# EasyEDA schematic DFPLAYER.json
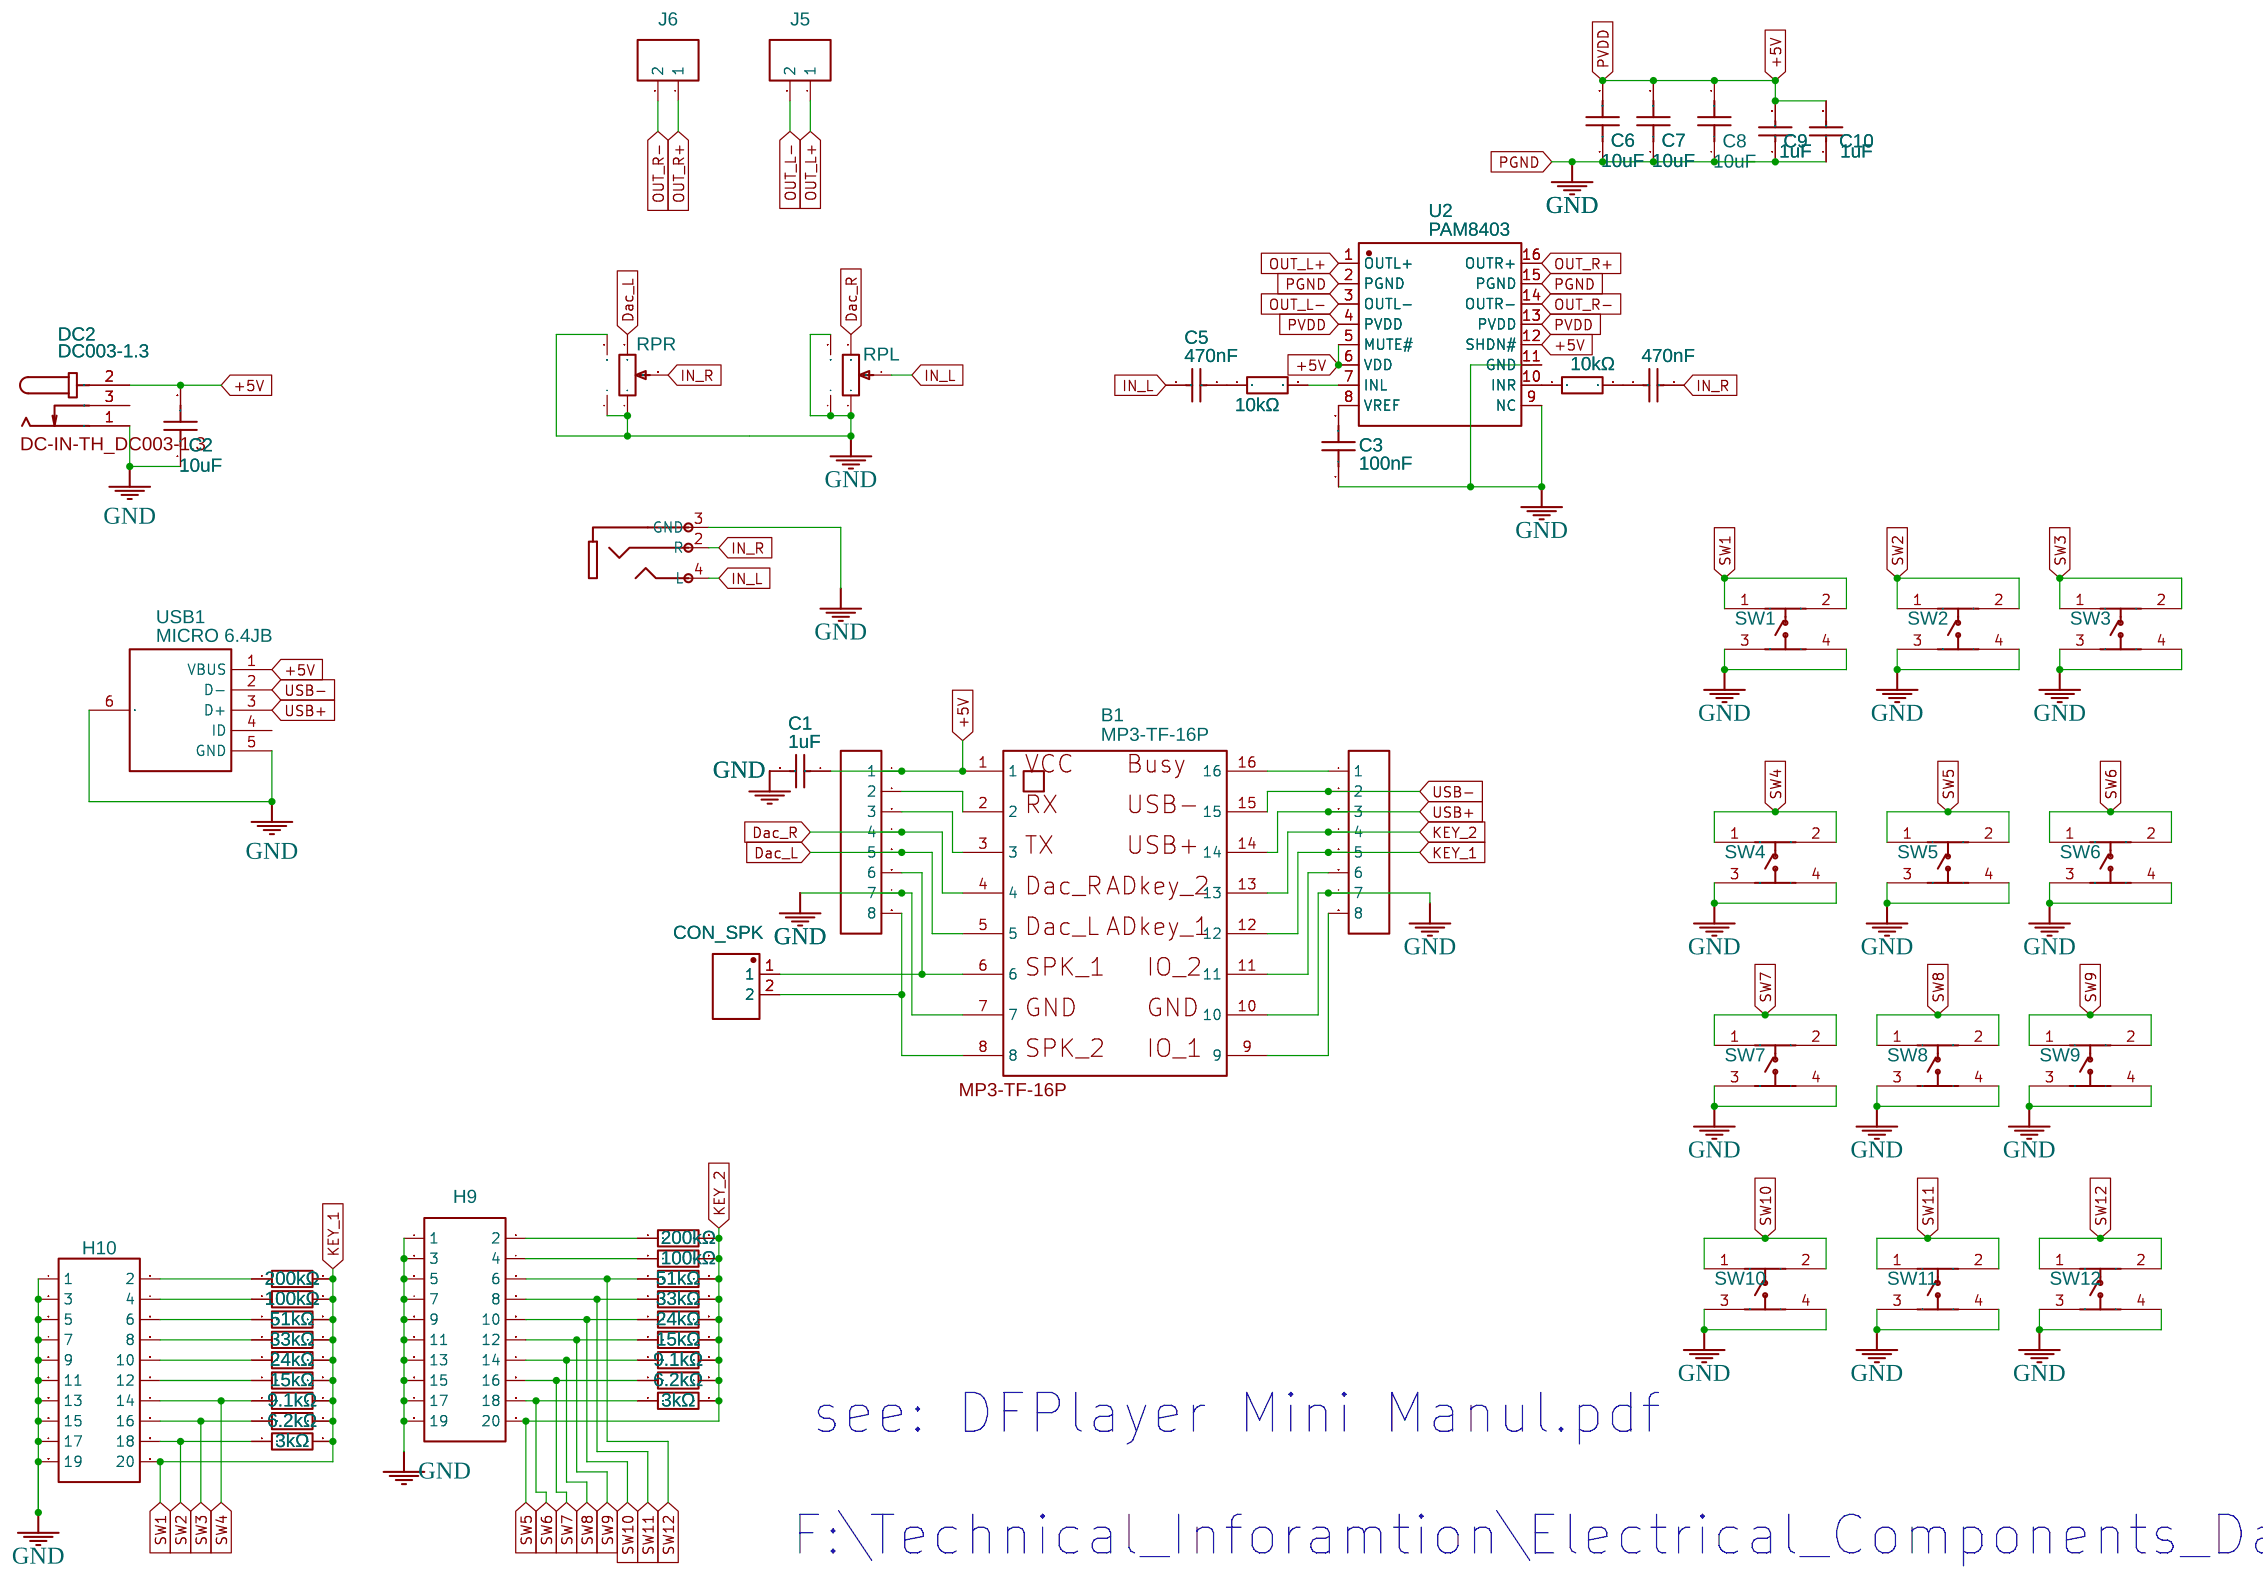
[diagram p0: schematic sheet]

## Parts
B1  MP3-TF-16P  [MP3-TF-16P]
C1  1uF  [C0603]
C2  10uF  [C0603]
C3  100nF  [C0603]
C4  470nF  [C0603]
C5  470nF  [C0603]
C6  10uF  [C0603]
C7  10uF  [C0603]
C8  10uF  [C0603]
C9  1uF  [C0603]
C10  1uF  [C0603]
CON_SPK  640456-2  [CONN-TH_KF2510-2A]
DC2  DC003-1.3  [DC-IN-TH_DC003-1.3]
H9  HDR-F-2.54_2x10  [HDR-F-2.54_2X10]
H10  HDR-F-2.54_2x10  [HDR-F-2.54_2X10]
J1  HDR-M-2.54_1x8  [HDR-M-2.54_1X8]
J2  HDR-M-2.54_1x8  [HDR-M-2.54_1X8]
J3  Black headphone jack  [AUDIO-TH_PJ-3200]
J5  HDR-M-2.54_1x2  [HDR-M-2.54_1X2]
J6  HDR-M-2.54_1x2  [HDR-M-2.54_1X2]
R2  3kΩ  [R0603]
R3  6.2kΩ  [R0603]
R4  9.1kΩ  [R0603]
R5  15kΩ  [R0603]
R6  24kΩ  [R0603]
R7  33kΩ  [R0603]
R8  51kΩ  [R0603]
R9  100kΩ  [R0603]
R10  200kΩ  [R0603]
R11  10kΩ  [R0603]
R12  3kΩ  [R0603]
R13  6.2kΩ  [R0603]
R14  9.1kΩ  [R0603]
R15  15kΩ  [R0603]
R16  24kΩ  [R0603]
R17  33kΩ  [R0603]
R18  51kΩ  [R0603]
R19  100kΩ  [R0603]
R20  200kΩ  [R0603]
R21  10kΩ  [R0603]
RPL  长柄旋转电位器  [RES-ADJ-TH_RV09]
RPR  长柄旋转电位器  [RES-ADJ-TH_RV09]
SW1  6.0*6.0*6.0  [SW-SMD_4P-L6.0-W6.0-P4.50-LS8.6]
SW2  6.0*6.0*6.0  [SW-SMD_4P-L6.0-W6.0-P4.50-LS8.6]
SW3  6.0*6.0*6.0  [SW-SMD_4P-L6.0-W6.0-P4.50-LS8.6]
SW4  6.0*6.0*6.0  [SW-SMD_4P-L6.0-W6.0-P4.50-LS8.6]
SW5  6.0*6.0*6.0  [SW-SMD_4P-L6.0-W6.0-P4.50-LS8.6]
SW6  6.0*6.0*6.0  [SW-SMD_4P-L6.0-W6.0-P4.50-LS8.6]
SW7  6.0*6.0*6.0  [SW-SMD_4P-L6.0-W6.0-P4.50-LS8.6]
SW8  6.0*6.0*6.0  [SW-SMD_4P-L6.0-W6.0-P4.50-LS8.6]
SW9  6.0*6.0*6.0  [SW-SMD_4P-L6.0-W6.0-P4.50-LS8.6]
SW10  6.0*6.0*6.0  [SW-SMD_4P-L6.0-W6.0-P4.50-LS8.6]
SW11  6.0*6.0*6.0  [SW-SMD_4P-L6.0-W6.0-P4.50-LS8.6]
SW12  6.0*6.0*6.0  [SW-SMD_4P-L6.0-W6.0-P4.50-LS8.6]
U2  PAM8403  [SOP-16_L10.0-W3.9-P1.27-LS6.0-BL]
USB1  MICRO 6.4JB  [MICRO-USB-SMD_C2681558]

## Library data of the parts
B1 = MP3-TF-16P: Contributor: exco; sourceId: QaGYSM3lD; Package Display: Yes
C1 C9 C10 = CL10A105KB8NNNC: Supplier: LCSC; Manufacturer: SAMSUNG(三星); Supplier Part: C15849; JLCPCB Part Class: Basic Part; Package Display: No
C2 C6-C8 = CL10A106MA8NRNC: Supplier: LCSC; Manufacturer: SAMSUNG(三星); Supplier Part: C96446; JLCPCB Part Class: Basic Part; Package Display: No
C3 = CC0603KRX7R9BB104: Supplier: LCSC; Manufacturer: YAGEO(国巨); Supplier Part: C14663; JLCPCB Part Class: Basic Part; Package Display: No
C4 C5 = CL10B474KA8NNNC: Supplier: LCSC; Manufacturer: SAMSUNG(三星); Supplier Part: C1623; JLCPCB Part Class: Basic Part; Package Display: No
CON_SPK = 640456-2: Supplier: LCSC; Manufacturer: TE Connectivity; Supplier Part: C86502; JLCPCB Part Class: Extended Part; Package Display: No
DC2 = DC003-1.3: Contributor: LCSC; Supplier: LCSC; Supplier Part: C668594; Manufacturer: SHOU HAN(首韩); JLCPCB Part Class: Extended Part; Package Display: Yes
H9 H10 = HDR-F-2.54_2x10: Supplier Part: C30867; Supplier: LCSC; Contributor: LCEDA_Lib; Package Display: No
J1 J2 = HDR-M-2.54_1x8: Supplier Part: C190820; Supplier: LCSC; Contributor: LCEDA_Lib; Package Display: No
J3 = Black headphone jack: Supplier: LCSC; Manufacturer: BOOMELE(博穆精密); Supplier Part: C18166; JLCPCB Part Class: Extended Part; Package Display: No
J5 J6 = HDR-M-2.54_1x2: Supplier Part: C124375; Supplier: LCSC; Contributor: LCEDA_Lib; Package Display: No
R2 R12 = 0603WAF3001T5E: Supplier: LCSC; Manufacturer: UNI-ROYAL(厚声); Supplier Part: C4211; JLCPCB Part Class: Basic Part; Package Display: No
R3 R13 = 0603WAF6201T5E: Supplier: LCSC; Manufacturer: UNI-ROYAL(厚声); Supplier Part: C4260; JLCPCB Part Class: Basic Part; Package Display: No
R4 R14 = 0603WAF9101T5E: Supplier: LCSC; Manufacturer: UNI-ROYAL(厚声); Supplier Part: C23260; Package Display: No
R5 R15 = 0603WAF1502T5E: Supplier: LCSC; Manufacturer: UNI-ROYAL(厚声); Supplier Part: C22809; JLCPCB Part Class: Basic Part; Package Display: No
R6 R16 = 0603WAF2402T5E: Supplier: LCSC; Manufacturer: UNI-ROYAL(厚声); Supplier Part: C23352; JLCPCB Part Class: Basic Part; Package Display: No
R7 R17 = 0603WAF3302T5E: Supplier: LCSC; Manufacturer: UNI-ROYAL(厚声); Supplier Part: C4216; JLCPCB Part Class: Basic Part; Package Display: No
R8 R18 = 0603WAF5102T5E: Supplier: LCSC; Manufacturer: UNI-ROYAL(厚声); Supplier Part: C23196; JLCPCB Part Class: Basic Part; Package Display: No
R9 R19 = 0603WAF1003T5E: Supplier: LCSC; Manufacturer: UNI-ROYAL(厚声); Supplier Part: C25803; JLCPCB Part Class: Basic Part; Package Display: No
R10 R20 = 0603WAF2003T5E: Supplier: LCSC; Manufacturer: UNI-ROYAL(厚声); Supplier Part: C25811; JLCPCB Part Class: Basic Part; Package Display: No
R11 R21 = 0603WAF1002T5E: Supplier: LCSC; Manufacturer: UNI-ROYAL(厚声); Supplier Part: C25804; JLCPCB Part Class: Basic Part; Package Display: No
RPL RPR = 长柄旋转电位器: Supplier: LCSC; Supplier Part: C2874842; Manufacturer: null; JLCPCB Part Class: Extended Part; Contributor: LCSC; Package Display: No
SW1-SW5 = 6.0*6.0*6.0: Contributor: lcsc; JLCPCB Part Class: Extended Part; Package Display: No
SW6-SW12 = 6.0*6.0*6.0: Contributor: lcsc; Supplier: LCSC; Supplier Part: C5127964; Manufacturer: BOOMELE(博穆精密); JLCPCB Part Class: Extended Part; Package Display: No
U2 = PAM8403: Contributor: lcsc; Supplier: LCSC; Supplier Part: C5122557; Manufacturer: Slkor(萨科微); Package Display: No
USB1 = MICRO 6.4JB: Contributor: LCSC; Supplier: LCSC; Supplier Part: C2681558; Manufacturer: SHOU HAN(首韩); JLCPCB Part Class: Extended Part; Package Display: No

## Nets
+5V: B1.1 C1.1 C2.2 C6.2 C7.2 C8.2 C9.2 C10.2 DC2.2 J1.1 U2.4(PVDD) U2.5(MUTE#) U2.6(VDD) U2.12(SHDN#) U2.13(PVDD) USB1.1(VBUS)
GND: B1.7 B1.10 C1.2 C2.1 C3.1 C6.1 C7.1 C8.1 C9.1 C10.1 DC2.1 H9.1 H9.3 H9.5 H9.7 H9.9 H9.11 H9.13 H9.15 H9.17 H9.19 H10.1 H10.3 H10.5 H10.7 H10.9 H10.11 H10.13 H10.15 H10.17 H10.19 J1.7 J2.7 J3.3(GND) RPL.1 RPL.4 RPL.5 RPR.1 RPR.4 RPR.5 SW1.3 SW1.4 SW2.3 SW2.4 SW3.3 SW3.4 SW4.3 SW4.4 SW5.3 SW5.4 SW6.3 SW6.4 SW7.3 SW7.4 SW8.3 SW8.4 SW9.3 SW9.4 SW10.3 SW10.4 SW11.3 SW11.4 SW12.3 SW12.4 U2.2(PGND) U2.9(NC) U2.15(PGND) USB1.5(GND) USB1.6(EH)
Dac_L: B1.5 J1.5 RPR.3
Dac_R: B1.4 J1.4 RPL.3
IN_L: C5.1 J3.4(L) RPL.2
IN_R: C4.2 J3.2(R) RPR.2
KEY_1: B1.12 H10.20 J2.5 R2.2 R3.2 R4.2 R5.2 R6.2 R7.2 R8.2 R9.2 R10.2 SW1.1 SW1.2
KEY_2: B1.13 H9.20 J2.4 R12.2 R13.2 R14.2 R15.2 R16.2 R17.2 R18.2 R19.2 R20.2 SW5.1 SW5.2
OUT_L+: J5.1 U2.1(OUTL+)
OUT_L-: J5.2 U2.3(OUTL-)
OUT_R+: J6.1 U2.16(OUTR+)
OUT_R-: J6.2 U2.14(OUTR-)
SW2: H10.18 R2.1 SW2.1 SW2.2
SW3: H10.16 R3.1 SW3.1 SW3.2
SW4: H10.14 R4.1 SW4.1 SW4.2
SW6: H9.18 R12.1 SW6.1 SW6.2
SW7: H9.16 R13.1 SW7.1 SW7.2
SW8: H9.14 R14.1 SW8.1 SW8.2
SW9: H9.12 R15.1 SW9.1 SW9.2
SW10: H9.10 R16.1 SW10.1 SW10.2
SW11: H9.8 R17.1 SW11.1 SW11.2
SW12: H9.6 R18.1 SW12.1 SW12.2
USB+: B1.14 J2.3 USB1.3(D+)
USB-: B1.15 J2.2 USB1.2(D-)
Net-(B1-2): B1.2 J1.2
Net-(B1-3): B1.3 J1.3
Net-(B1-6): B1.6 CON_SPK.1 J1.6
Net-(B1-8): B1.8 CON_SPK.2 J1.8
Net-(B1-9): B1.9 J2.8
Net-(B1-11): B1.11 J2.6
Net-(B1-16): B1.16 J2.1
Net-(C3-2): C3.2 U2.8(VREF)
Net-(C4-1): C4.1 R21.2
Net-(C5-2): C5.2 R11.1
Net-(H9-2): H9.2 R20.1
Net-(H9-4): H9.4 R19.1
Net-(H10-2): H10.2 R10.1
Net-(H10-4): H10.4 R9.1
Net-(H10-6): H10.6 R8.1
Net-(H10-8): H10.8 R7.1
Net-(H10-10): H10.10 R6.1
Net-(H10-12): H10.12 R5.1
Net-(R11-2): R11.2 U2.7(INL)
Net-(R21-1): R21.1 U2.10(INR)

Not connected (* = marked no-connect by the designer): DC2 3; U2 11(GND); USB1 4(ID)

## Notes on the sheet
- see: DFPlayer Mini Manul.pdf
- F:\Technical_Inforamtion\Electrical_Components_Data_Sheet\Sound&Voice_Procecors
